# Altium project Bram_Vanderwegen_Project_Ontwerpen_Boost_Converter.PrjPcb
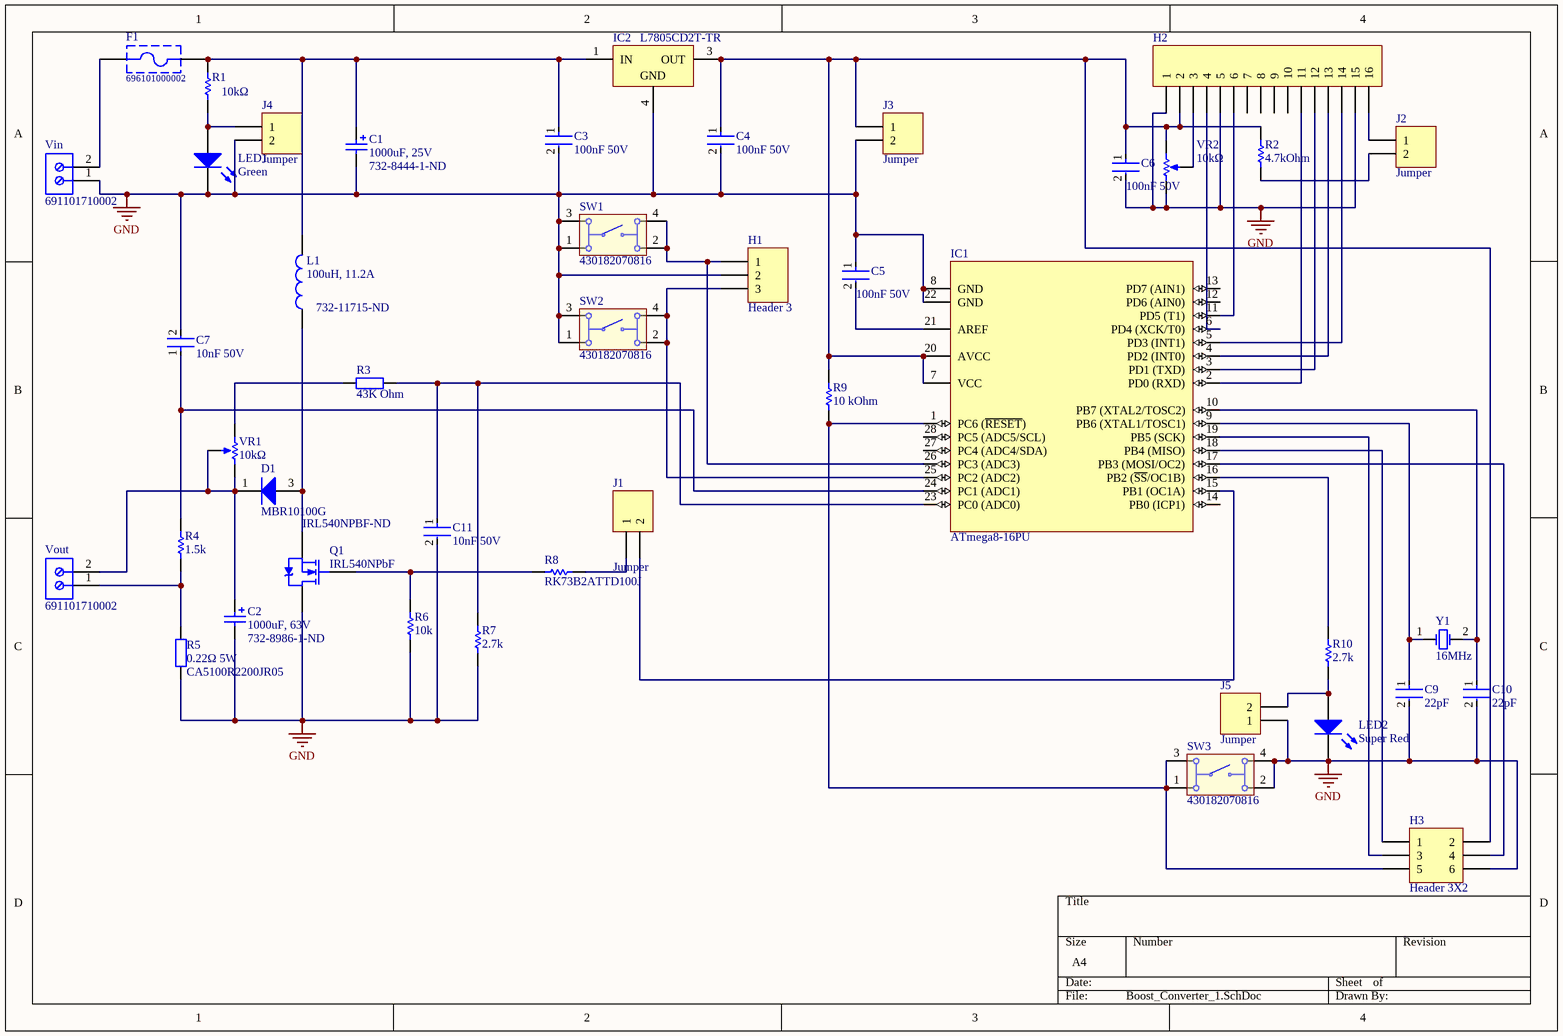
[diagram p0: Boost_Converter_1.SchDoc]
1 sheet, 44 parts. Net scope: global (net labels, ports and power ports of the same name join across sheets).
Board file: PCB_Version_1.PcbDoc

## Sheet Boost_Converter_1.SchDoc
size A4; SheetNumber: 1; SheetTotal: 1

### Parts
C1  1000uF, 25V  Supplier Part Number 1: 732-8444-1-ND  [WCAP-ASLI_D12.5H14]
C2  1000uF, 63V  Supplier Part Number 1: 732-8986-1-ND  [WCAP-ATG5_D16H31.5]
C3  100nF 50V  [FP-GCD21B-0_15-IPC_C]
C4  100nF 50V  [FP-GCD21B-0_15-IPC_C]
C5  100nF 50V  [FP-CL31-IPC_C]
C6  100nF 50V  [FP-CL31-IPC_C]
C7  10nF 50V  [FP-CL21-IPC_C]
C9  22pF  [FP-C0805C-DN-MFG]
C10  22pF  [FP-C0805C-DN-MFG]
C11  10nF 50V  [FP-CL21-IPC_C]
D1  MBR10100G  [ONSC-TO-220-2-221B-04_E]
F1  696101000002  [696101000002]
H1  Header 3  [HDR1X3]
H2  Header 16  [HDR1X16]  (value not drawn)
H3  Header 3X2  [HDR2X3]
IC1  ATmega8-16PU  [28P3]
IC2  L7805CD2T-TR  [TO-263_M]
J1  Jumper  [HDR1X2H]
J2  Jumper  [HDR1X2H]
J3  Jumper  [HDR1X2H]
J4  Jumper  [HDR1X2H]
J5  Jumper  [HDR1X2H]
L1  100uH, 11.2A  Supplier Part Number 1: 732-11715-ND  [WE-HCF_2920]
LED1  Green  [0805_A]
LED2  Super Red  [0805_A]
Q1  IRL540NPbF  Supplier Part Number 1: IRL540NPBF-ND  [TO-220AB]
R1  10kΩ  [RESC2013X60X35NL10T20]
R2  4.7kOhm  [RESC2013X60X40ML20T25]
R3  43K Ohm  [AXIAL-0.4]
R4  1.5k  [RESC2013X60X35LL10T20]
R5  0.22Ω 5W  Supplier Part Number 1: CA5100R2200JR05  [AXIAL-0.7]
R6  10k  [RESC2013X60X35NL10T20]
R7  2.7k  [RESC2013X50X30NL20T20]
R8  RK73B2ATTD100J  [RESC2013X60X30ML20T20]
R9  10 kOhm  [RESC2013X60X35NL10T20]
R10  2.7k  [RESC2013X50X30NL20T20]
SW1  430182070816  [430182070816]
SW2  430182070816  [430182070816]
SW3  430182070816  [430182070816]
Vin  691101710002  [691101710002]
Vout  691101710002  [691101710002]
VR1  10kΩ  [10k_trimmer]
VR2  10kΩ  [10k_trimmer]
Y1  16MHz  [WE-XTAL_HC49/4HSMX]

### Nets
GND: C1.2(N) C2.2(N) C3.2 C4.2 C5.1 C6.2 C7.2 C9.2 C10.2 C11.2 H1.2 H2.1 H2.5 H2.15 H3.6 IC1.8(GND) IC1.22(GND) IC2.4(GND) J3.2 J4.2 J5.1 LED1.1(K) LED2.1(K) Q1.2(D) R5.1 R6.1 R7.1 SW1.1 SW1.3 SW2.1 SW2.3 SW3.2 SW3.4 Vin.1 VR2.3(CW)
NetC1_1: C1.1(P) C3.1 F1.2 IC2.1(IN) L1.2 R1.2
NetC2_1: C2.1(P) D1.1(K) Vout.2 VR1.1(CCW) VR1.2(WIPER)
NetC4_1: C4.1 C6.1 H2.2 H3.2 IC1.7(VCC) IC1.20(AVCC) IC2.3(OUT) J3.1 R2.2 R9.2 VR2.1(CCW)
NetC5_2: C5.2 IC1.21(AREF)
NetC7_1: C7.1 IC1.24(PC1_(ADC1)) R4.2
NetC9_1: C9.1 IC1.9(PB6_(XTAL1/TOSC1)) Y1.1(OSC1)
NetC10_1: C10.1 IC1.10(PB7_(XTAL2/TOSC2)) Y1.2(OSC2)
NetC11_1: C11.1 IC1.23(PC0_(ADC0)) R3.2 R7.2
NetD1_3: D1.3(A) L1.1 Q1.3(S)
NetF1_1: F1.1 Vin.2
NetH1_1: H1.1 IC1.26(PC3_(ADC3)) SW1.2 SW1.4
NetH1_3: H1.3 IC1.25(PC2_(ADC2)) SW2.2 SW2.4
NetH2_3: H2.3 VR2.2(WIPER)
NetH2_4: H2.4 IC1.6(PD4_(XCK/T0))
NetH2_6: H2.6 IC1.11(PD5_(T1))
NetH2_11: H2.11 IC1.2(PD0_(RXD))
NetH2_12: H2.12 IC1.3(PD1_(TXD))
NetH2_13: H2.13 IC1.4(PD2_(INT0))
NetH2_14: H2.14 IC1.5(PD3_(INT1))
NetH2_16: H2.16 J2.1
NetH3_1: H3.1 IC1.18(PB4_(MISO))
NetH3_3: H3.3 IC1.19(PB5_(SCK))
NetH3_4: H3.4 IC1.17(PB3_(MOSI/OC2))
NetH3_5: H3.5 IC1.1(PC6_(~{RESET})) R9.1 SW3.1 SW3.3
NetIC1_15: IC1.15(PB1_(OC1A)) J1.2
NetIC1_16: IC1.16(PB2_(~{SS}/OC1B)) R10.2
NetJ1_1: J1.1 R8.2
NetJ2_2: J2.2 R2.1
NetJ4_1: J4.1 LED1.2(A) R1.1
NetJ5_2: J5.2 LED2.2(A) R10.1
NetQ1_1: Q1.1(G) R6.2 R8.1
NetR3_1: R3.1 VR1.3(CW)
NetR4_1: R4.1 R5.2 Vout.1

Not connected (* = marked no-connect by the designer): H2 7 8 9 10; IC1 12(PD6_(AIN0)) 13(PD7_(AIN1)) 14(PB0_(ICP1)) 27(PC4_(ADC4/SDA)) 28(PC5_(ADC5/SCL))

### Library data of the parts
C1 = 865080462016: WCAP-ASLI Aluminum Electrolytic Capacitor, V-Chip, SMT, D12.5xH14mm, 1000uF, 25V; Manufacturer: Wurth Elektronik; Technical Reference: ASEH140102M025DVCTGB000; Ripple Current: 1100mA; Capacitance Tolerance: +/-20%; Leakage Current: 250uA; Endurance: 2000h; Dissipation Factor: 14%; Rated Voltage: 25VDC; Packaging: Tape and Reel; Published Date: October 2020; Operating Temperature: -55 to +105degC; Mounting Technology: SMT; Manufacturer Part Number: 865080462016; Height: 14mm; Capacitance: 1000uF; ComponentLink1Description: Manufacturer; ComponentLink1URL: http://www.we-online.de; ComponentLink2Description: Datasheet; ComponentLink2URL: https://www.we-online.com/catalog/datasheet/865080462016.pdf; Diameter: 12.5mm; Supplier 1: Digi-Key
C2 = 860020780025: CAP ALUM 1000UF 20% 63V RADIAL; Manufacturer: Wurth Elektronik; Endurance: 2000h; Ripple Current: 1185mA; Technical Reference: ATDK315102M063DSPADB000; Dissipation Factor: 9%; Capacitance Tolerance: +/-20%; Leakage Current: 630uA; Rated Voltage: 63VDC; Polarity: Polar; Life (Hours): 2000Hour; Height: 31.5mm; ComponentLink1URL: http://www.we-online.de; ComponentLink2URL: https://www.we-online.com/catalog/datasheet/860020780025.pdf; ComponentLink2Description: Datasheet; Diameter: 16mm; Mounting Technology: THT; Capacitance: 1000uF; Manufacturer Part Number: 860020780025; Packaging: Ammo Pack; Published Date: October 2020; ComponentLink1Description: Manufacturer; Operating Temperature: -40 to +105degC; Supplier 1: Digi-Key; RoHS: Yes; Category: Aluminum Electrolytic Capacitors; Stock 1: 70; Pricing 1: 1=2,37000, 50=2,01700, 100=1,75700 (USD); Mount: Through Hole; Case/Package: Radial; Min Operating Temperature: -40°C; Max Operating Temperature: 105°C; Package Quantity: 250; Voltage Rating: 63V; Tolerance: 20%; Voltage Rating (DC): 63V; Lead Pitch: 0.295inch; Height - Seated (Max): 1.299inch; REACH SVHC: Unknown; RoHS Compliant: Yes; ComponentLink3URL: http://www.farnell.com/datasheets/1879699.pdf?src-supplier=Farnell; ComponentLink3Description: http://www.farnell.com/datasheets/1879699.pdf?src-supplier=Farnell; ComponentLink4URL: https://katalog.we-online.de/pbs/datasheet/860020780025.pdf?src-supplier=Digi-Key; ComponentLink4Description: https://katalog.we-online.de/pbs/datasheet/860020780025.pdf?src-supplier=Digi-Key; ComponentLink5URL: http://www.farnell.com/datasheets/1879699.pdf?src-supplier=Element14; ComponentLink5Description: http://www.farnell.com/datasheets/1879699.pdf?src-supplier=Element14; ComponentLink6URL: http://katalog.we-online.de/pbs/datasheet/860020780025.pdf?src-supplier=Digi-Key; ComponentLink6Description: http://katalog.we-online.de/pbs/datasheet/860020780025.pdf?src-supplier=Digi-Key
C3 C4 = CMP-06035-045527-1: Chip Multilayer Ceramic Capacitors for Automotive, 0805, 0.10uF, X7R, 15%, 10%, 50V, Grade 1; Case Code (Metric): 2012; Voltage Rating: 50V; Height: 1.25mm; Weight: 0.000335oz; Mount: Surface Mount; Width: 0.049inch; Packaging: Tape and Reel; Min Operating Temperature: -55°C; Depth: 1.25mm; Length: 2mm; Max Operating Temperature: 125°C; Ratings: AEC-Q200; Termination: SMD/SMT; Capacitance: 100nF; Thickness: 0.049inch; Case/Package: 0805; Voltage Rating (DC): 50V; Dielectric: X7R; Case Code (Imperial): 0805; Tolerance: 10%; Package Quantity: 3000
C5 C6 = CMP-13271-001731-1: Cap Ceramic 100nF 50V X7R ±10% SMD 1206 +125°C Embossed T/R; Voltage: 50V; Thickness: 0.037inch; Lead Free: Lead Free; Length: 3.2mm; Min Operating Temperature: -55°C; Package Quantity: 15000; Packaging: Tape and Reel; Mount: Surface Mount; Depth: 1.6mm; Case/Package: 1206; Voltage Rating (DC): 50V; Tolerance: 10%; Height: 0.85mm; Capacitance: 100nF; Radiation Hardening: No; Dielectric: X7R; Voltage Rating: 50V; Max Operating Temperature: 125°C; Width: 0.063inch
C7 C11 = CMP-13271-002413-1: CL21 Series 0805 10nF 50V ±10% Tolerance X7R Multilayer Ceramic Chip Capacitor; Radiation Hardening: No; Width: 0.049inch; Case/Package: 0805; Voltage Rating: 50V; Package Quantity: 1; Depth: 1.25mm; Height: 0.65mm; Dielectric: X7R; Length: 0.079inch; Min Operating Temperature: -55°C; Contact Plating: Tin; Case Code (Imperial): 0805; Packaging: Tape and Reel; Lead Free: Lead Free; Tolerance: 10%; Max Operating Temperature: 125°C; Thickness: 0.03inch; Mount: Surface Mount; Capacitance: 10nF; Case Code (Metric): 2012
C9 C10 = CMP-03020-018552-1: CAP CER 22PF 50V C0G/NP0 0805; Manufacturer Part Number: C0805C220J5GAC7210; Manufacturer: KEMET; Material: Ceramic; Temperature Coefficient: 30ppm/°C; Tolerance: 0.05; Temperature Characteristic: C0G; Capacitance: 22 pF; Octopart: https://octopart.com/c0805c220j5gac7210-kemet-3882539; Automotive: No; ComponentLink2Description: Datasheet; Temperature Range High: +125°C; Height: 0.88mm; Device Class L3: Ceramic Capacitors; Lead Free: Yes; Package: C0805C-DN; Digikey Description: CAP CER 22PF 50V C0G/NP0 0805; Ipc Land Pattern Name: CAPC200125X78; Value: 22 pF; Temperature: -55°C to +125°C; Voltage Rating: 50 V; Category: Cap; ComponentLink2URL: https://content.kemet.com/datasheets/KEM_C1003_C0G_SMD.pdf; RoHS: TRUE; Temperature Range Low: -55°C; Device Class L2: Capacitors; Device Class L1: Passive Components
D1 = CMP-1055-00601-1: SWITCHMODE(TM) Power Rectifier, 2-Pin TO-220, Pb-Free, Tube; Manufacturer: On Semiconductor; Configuration: Single; IFSM Max (A): 150; Mounting Technology: Through Hole; ComponentLink1URL: http://www.onsemi.com/; PartNumber: MBR10100G; ComponentLink1Description: Manufacturer URL; ComponentLink3URL: http://www.onsemi.com/pub_link/Collateral/BYW29-D.PDF; PackageDescription: 2-Pin Flange Mount, Vertical Straight Lead, Body 9.97 x 4.44 mm, Pitch 5.08 mm; DatasheetVersion: Rev. 1; PackageVersion: Rev. E; ComponentLink2Description: Datasheet; ComponentLink2URL: http://www.onsemi.cn/pub_link/Collateral/MBR1080-D.PDF; Packing: Tube; RoHS: TRUE; PackageReference: TO-220-2-221B-04_E; ComponentLink3Description: Package Specification
F1 = 696101000002: WR-FSH Fuse Holder Blocks Fuse Holder Blocks Clip Cover for PCB; Fuse Size: 5x20 mm; ComponentLink1Description: Manufacturer; ComponentLink1URL: http://www.we-online.de; ComponentLink2Description: Datasheet; ComponentLink2URL: https://katalog.we-online.de/em/datasheet/696101000002.pdf; Part Number: 696101000002; Published Date: August 2018; Publisher: Wurth Elektronik; Operating Temperature: -30 to 120 degC; Mounting Technology: THT; Packaging: Box
H1 = Header 3: Header, 3-Pin; LatestRevisionDate: 17-Jul-2002; LatestRevisionNote: Re-released for DXP Platform.; Publisher: Altium Limited
H2 = Header 16: Header, 16-Pin; LatestRevisionDate: 17-Jul-2002; LatestRevisionNote: Re-released for DXP Platform.; Publisher: Altium Limited
H3 = Header 3X2: Header, 3-Pin, Dual row; LatestRevisionDate: 17-Jul-2002; LatestRevisionNote: Re-released for DXP Platform.; Publisher: Altium Limited
IC1 = CMP-0095-00372-1: 8-bit AVR Microcontroller, 4.5-5.5V, 16MHz, 8KB Flash, 512 Bytes EEPROM, 1KB SRAM, 28-pin PDIP, Industrial Grade (-40°C to 85°C); ComponentLink3URL: http://www.atmel.com/dyn/resources/prod_documents/2486S.pdf; ComponentLink3Description: ATmega8(L) Summary; PackageDescription: 28-lead (0.300"/7.62mm Wide) Plastic Dual Inline Package (PDIP); ComponentLink2Description: ATmega8(L); ComponentLink1URL: http://www.atmel.com/; PackageVersion: revB, Sep-2001; ComponentLink1Description: Manufacturer URL; ComponentLink2URL: http://www.atmel.com/dyn/resources/prod_documents/doc2486.pdf; PackageReference: 28P3; DatasheetVersion: revZ, Feb-2011
IC2 = CMP-0244-00213-1: Positive Voltage Regulator, 3-Pin D2PAK, Tape and Reel; PackageReference: TO-263; ComponentLink2URL: http://www.st.com/internet/com/TECHNICAL_RESOURCES/TECHNICAL_LITERATURE/DATASHEET/CD00000444.pdf; PackageDescription: 3-Pin Transistor Outline Package 2.54 mm Pitch, 15.4 mm Lead Span (D2PAK); DatasheetVersion: 16/11/2011; ComponentLink2Description: Datasheet; ComponentLink1Description: Manufacturer URL; PackageVersion: 2011; ComponentLink1URL: http://www.st.com
J1-J5 = Header 2H: Header, 2-Pin, Right Angle; LatestRevisionDate: 17-Jul-2002; LatestRevisionNote: Re-released for DXP Platform.; Publisher: Altium Limited
L1 = 74437529203101: WE-HCF SMT High Current Inductor, size 2920, 100uH, 11.2A, 25.19mOhm; Manufacturer: Wurth Elektronik; Self Resonant Frequency: 4.3MHz; DC Resistance typ.: 22.9mOhm; Saturation Current: 9.4A; ComponentLink1Description: Manufacturer; ComponentLink1URL: http://www.we-online.de; ComponentLink2Description: Datasheet; ComponentLink2URL: https://www.we-online.com/catalog/datasheet/74437529203101.pdf; Mounting Technology: SMT; Operating Temperature: -40 to +125degC; Packaging: Tray and Carton; Published Date: September 2020; DC Resistance max.: 25.19mOhm; Inductance: 100uH; Manufacturer Part Number: 74437529203101; Rated Current: 11.2A; Size: 2920; Supplier 1: Digi-Key
LED1 = CMP-1426-00007-1: SMD mono-color Chip LED, WL-SMCW, Green; PartNumber: 150080GS75000; Manufacturer: Wuerth Elektronik; PackageReference: 0805_A; Color: Green; ComponentLink2URL: http://katalog.we-online.com/led/datasheet/150080GS75000.pdf; ComponentLink1URL: http://www.we-online.com; ComponentLink1Description: Manufacturer URL; ComponentLink2Description: Datasheet
LED2 = CMP-1426-00010-1: SMD mono-color Chip LED, WL-SMCW, Super Red; Manufacturer: Wuerth Elektronik; PartNumber: 150080SS75000; PackageReference: 0805_A; ComponentLink2URL: http://katalog.we-online.com/led/datasheet/150080SS75000.pdf; ComponentLink1URL: http://www.we-online.com; Color: Super Red; ComponentLink2Description: Datasheet; ComponentLink1Description: Manufacturer URL
Q1 = NMOS-2: Trans MOSFET N-CH 100V 36A 3-Pin(3+Tab) TO-220AB; Manufacturer: International Rectifier; Note: Pin 2 is electrically connected to pin 4.; Gate to Source Voltage (Vgs): 16V; Turn-On Delay Time: 11ns; Turn-Off Delay Time: 39ns; Rise Time: 81ns; Fall Time: 62ns; Input Capacitance: 1.8nF; Max Power Dissipation: 140W; Rds On Max: 44mR; Drain to Source Resistance: 63mR; Element Configuration: Single; Nominal Vgs: 2V; Number of Elements: 1; Recovery Time: 290ns; On-State Resistance: 53mR; Published: 8-Jun-2000; LatestRevisionDate: 17-Jul-2002; LatestRevisionNote: Re-released for DXP Platform.; DatasheetVersion: PD-9.814; PackageVersion: Feb-1997; PackageReference: TO-220AB; Publisher: Altium Limited; PackageDescription: TO, Thru-Hole, Vertical, Heatsink Mounted; 3 In-Line Leads; Pitch 2.54 mm; ComponentLink1Description: Manufacturer Link; ComponentLink1URL: http://www.irf.com/; Supplier 1: Digi-Key; Manufacturer Part Number: IRL540NPBF; RoHS: Yes; Category: MOSFETs; Stock 1: 6708; Pricing 1: 1=1,24000, 10=1,01100, 25=0,99200, 100=0,78610, 500=0,66628, 1000=0,54276, 2500=0,51094, 5000=0,49342 (USD); Mount: Through Hole; Case/Package: TO-220AB; Number of Pins: 3; Min Operating Temperature: -55°C; Max Operating Temperature: 175°C; Continuous Drain Current (ID): 36A; Packaging: Rail/Tube; Drain to Source Voltage (Vdss): 100V; Drain to Source Breakdown Voltage: 100V; Power Dissipation: 140W; Package Quantity: 50; Dual Supply Voltage: 100V; Termination: Through Hole; Voltage Rating (DC): 100V; Current Rating: 36A; Series: HEXFET®; Drain-source On Resistance-Max: 53mR; Length: 10.54mm; Width: 4.69mm; Height: 8.77mm; Lead Pitch: 2.54mm; RoHS Compliant: Yes; REACH SVHC: No SVHC; Lead Free: Lead Free; ComponentLink2URL: https://datasheet.ciiva.com/7835/irl540npbf-7835764.pdf?src-supplier=Element14; ComponentLink2Description: https://datasheet.ciiva.com/7835/irl540npbf-7835764.pdf?src-supplier=Element14; ComponentLink3URL: https://datasheet.ciiva.com/14170/kkirl540n-data-e-14170372.pdf?src-supplier=Distrelec; ComponentLink3Description: https://datasheet.ciiva.com/14170/kkirl540n-data-e-14170372.pdf?src-supplier=Distrelec; ComponentLink4URL: https://datasheet.ciiva.com/29326/162798-da-01-en-irf-540n-29326742.pdf?src-supplier=Conrad; ComponentLink4Description: https://datasheet.ciiva.com/29326/162798-da-01-en-irf-540n-29326742.pdf?src-supplier=Conrad; ComponentLink5URL: https://datasheet.ciiva.com/6368/irl540npbf-6368261.pdf?src-supplier=Digi-Key; ComponentLink5Description: https://datasheet.ciiva.com/6368/irl540npbf-6368261.pdf?src-supplier=Digi-Key; ComponentLink6URL: https://datasheet.ciiva.com/16395/irl540npbf-16395612.pdf?src-supplier=Future+Electronics; ComponentLink6Description: https://datasheet.ciiva.com/16395/irl540npbf-16395612.pdf?src-supplier=Future+Electronics
R1 R6 R9 = CMP-1659-00013-4: Chip Resistor, 10 KOhm, +/- 1%, 0.125 W, -55 to 155 degC, 0805 (2012 Metric), RoHS, Tape and Reel; Manufacturer: Yageo; Voltage Rating: 150 V; Mount: Surface Mount; ComponentLink1Description: Manufacturer URL; ComponentLink2URL: http://www.yageo.com/documents/recent/PYu-RC_Group_51_RoHS_L_04.pdf; Pins: 2; Length: 2 mm; Min Operating Temperature: -55 degC; Height: 0.5 mm; Mounting Technology: Surface Mount; RoHSCompliant: true; REACH SVHC: No SVHC; ComponentLink1URL: http://www.yageo.com/; Max Operating Temperature: 155 degC; PackageReference: 0805; DatasheetVersion: Rev. 4, 02/2016; Package Quantity: 5000; Packaging: Tape and Reel; ComponentLink2Description: Datasheet; PackageDescription: 2-Pin Surface Mounted Device, Body 2 x 1.25 mm
R2 = CMP-2001-00644-1: Part Number: ERA6AEB472V; Manufacturer: Panasonic
R3 = Res2: Res Metal Film 43K Ohm 1% 0.6W ±50ppm/C Conformal Coated AXL Ammo; Manufacturer: Yageo; Manufacturer Part Number: MF0207FTE52-43K; Resistance: 43kR; Temperature Coefficient: 50ppm/°C; Published: 8-Jun-2000; LatestRevisionDate: 17-Jul-2002; LatestRevisionNote: Re-released for DXP Platform.; PackageReference: AXIAL-0.4; Publisher: Altium Limited; PackageDescription: Axial Device, Thru-Hole; 2 Leads; 0.4 in Pin Spacing; Value: 43K; Supplier 1: Digi-Key; Supplier Part Number 1: MF0207FTE52-43K-ND; RoHS: Yes; Category: Through-Hole Resistors; Pricing 1: 5000=0,01445 (USD); Mount: Through Hole; Case/Package: Conformal; Contact Plating: Tin,Matte; Min Operating Temperature: -55°C; Max Operating Temperature: 155°C; Tolerance: 1%; Resistor Type: Metal Film; Termination: Axial; Packaging: Ammo Pack; Construction: Cylindrical; Diameter: 2.3mm; Length: 6.3mm; Radiation Hardening: No; Military Standard: Not; RoHS Compliant: Yes; ComponentLink1URL: http://components.arrow.com/part/dataview/0323_02063068?src-supplier=Arrow+Europe; ComponentLink1Description: http://components.arrow.com/part/dataview/0323_02063068?src-supplier=Arrow+Europe; ComponentLink2URL: https://www.distrelec.biz/Web/Downloads/_t/ds/MFxx_eng_tds.pdf?mime=application%2Fpdf&src-supplier=Distrelec; ComponentLink2Description: https://www.distrelec.biz/Web/Downloads/_t/ds/MFxx_eng_tds.pdf?mime=application%2Fpdf&src-supplier=Distrelec; ComponentLink3URL: http://www.yageo.com/documents/recent/Leaded-R_MF0_2011.pdf?src-supplier=Avnet+Europe; ComponentLink3Description: http://www.yageo.com/documents/recent/Leaded-R_MF0_2011.pdf?src-supplier=Avnet+Europe; ComponentLink4URL: http://www.yageo.com/documents/recent/Yageo%20LR_MF0_2013.pdf?src-supplier=Avnet; ComponentLink4Description: http://www.yageo.com/documents/recent/Yageo%20LR_MF0_2013.pdf?src-supplier=Avnet
R4 = CMP-2001-04524-1: Part Number: RC0805JR-131K5L; Manufacturer: Yageo
R5 = Res2: Resistor; Published: 8-Jun-2000; LatestRevisionDate: 17-Jul-2002; LatestRevisionNote: Re-released for DXP Platform.; PackageReference: AXIAL-0.4; Publisher: Altium Limited; PackageDescription: Axial Device, Thru-Hole; 2 Leads; 0.4 in Pin Spacing; Value: 0.22Ω; Supplier 1: Arrow Electronics
R7 R10 = CMP-2001-03776-1: Part Number: CRCW08052K70JNEA; Manufacturer: Vishay Dale
R8 = CMP-2001-04579-1: Manufacturer: KOA Speer; Part Number: RK73B2ATTD100J
SW1-SW3 = CMP-1452-00015-1: WS-TASV SMD Tact Switch 6X6 mm; Manufacturer: Wuerth Elektronik; NoPins: 04; ComponentLink2URL: http://katalog.we-online.de/em/datasheet/4301x2.pdf; ComponentLink1URL: http://www.we-online.com; PartNumber: 430182070816; PackageReference: 430182070816; ComponentLink2Description: Datasheet; ComponentLink1Description: Manufacturer URL
Vin Vout = CMP-1502-03256-1: Series 101 - 5.00 mm Horizontal Entry Modular with Pressure Clamp WR-TBL, 2 pin; Manufacturer: Wurth Elektronik; Pin Number: 2; Pitch: 5.00mm; Package Reference: 691101710002; Part Number: 691101710002; Publisher: WurthElektronik; Datasheet URL: http://katalog.we-online.de/em/datasheet/6911017100xx.pdf; Packaging: Box; Operating Temperature: -40to105degC; Manufacturer URL: http://www.we-online.de; Mounting Technology: THT
VR1 VR2 = CMP-2000-05078-1: Square Trimming Potentiometer, 10 KOhm, 500 mW, -55 to 125 degC, 3-Pin THD, RoHS, Tube; Manufacturer Part Number: 3299W-1-103LF; Brand: Bourns; Power Rating: 500mW(1/2W); Unit Weight: 0.035000oz; Qualification: Commercial; Element Type: Cermet; Resistance: 10kOhms; Tolerance: 10%; Temperature Coefficient: 100PPM/C; Voltage Rating: 300V; Adjustment: TopCrossed; Product: Multiturn; Datasheet Version: Sep-04; Datasheet URL: https://datasheet.ciiva.com/19482/769696-19482212.pdf; RoHS: True; Tradename: Trimpot; Product Type: SquareTrimmingPotentiometer; Mounting: PanelMount; Packaging: Tube; Package Reference: 3299W; Operating Temperature Range: -55Cto+125C; Length: 10.03mm; Termination Style: Pin; Manufacturer: Bourns; Manufacturer URL: http://www.bourns.com/; Product Category: TrimmerResistors-ThroughHole; Width: 9.53mm; Taper: Linear; Package Description: 3-Pin Surface Mount Device, Body 9.53 x 6.1 mm, Pitch 2.54 mm; Type: Trimmers; Series: 3299
Y1 = 830051235: WE-XTAL Quartz Crystal, SMT, HC49/4HSMX, 16MHz, +/-30ppm; Manufacturer: Wurth Elektronik; Frequency Stability: +/-50ppm; Load Capacitance: 18pF; ComponentLink1Description: Manufacturer; ComponentLink1URL: http://www.we-online.de; ComponentLink2Description: Datasheet; ComponentLink2URL: https://katalog.we-online.com/pbs/datasheet/830051235.pdf; Operating Temperature: -40 to +85degC; Packaging: Tape and Reel; Manufacturer Part Number: 830051235; Published Date: July 2020; Size: HC49/4HSMX; Frequency: 16MHz; Frequency Tolerance: +/-30ppm; Mounting Technology: SMT